# Altium schematic sheet Base.SchDoc
size Letter; CompanyName: Ploopy Corporation; Organization: Ploopy Corporation; Address1: 137-1140 Burnhamthorpe Road W; Address2: Mississauga; Address3: Ontario; Address4: Canada L5C 0A3; DocumentNumber: 1; Revision: R1.007; SheetNumber: 1; SheetTotal: 9
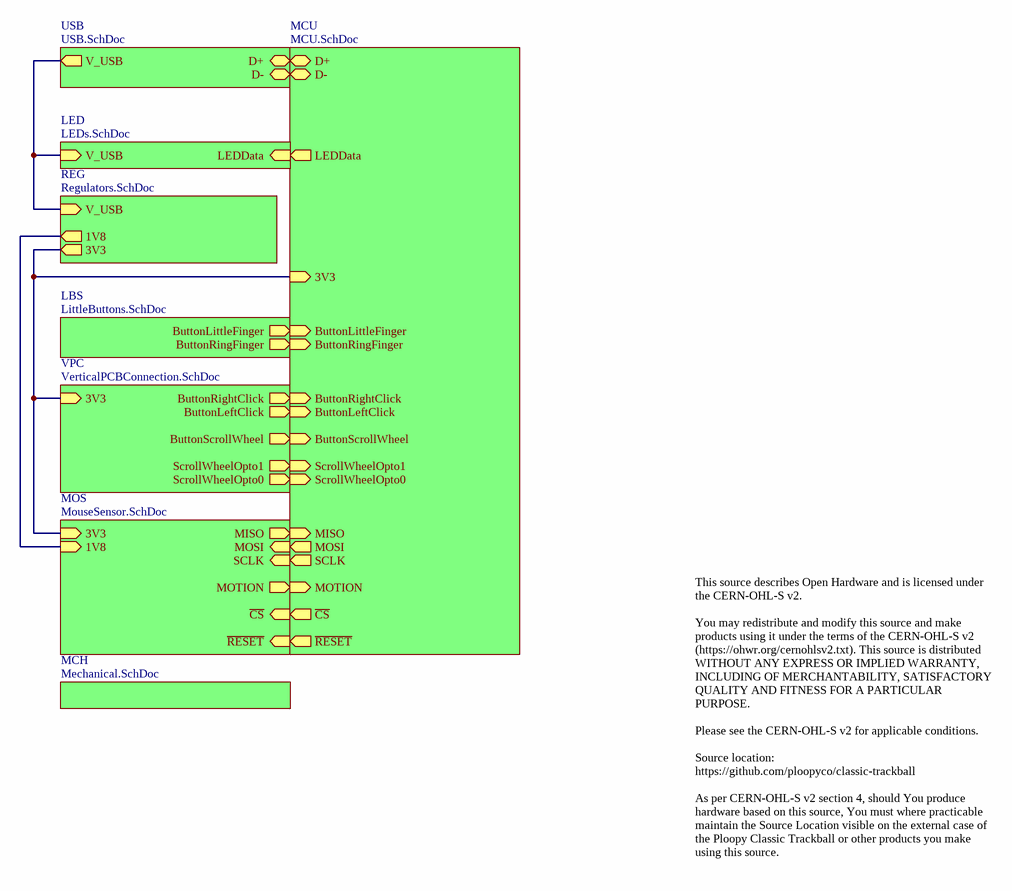
[diagram p0: Base.SchDoc]

## Sub-sheets
LBS = LittleButtons.SchDoc: ButtonLittleFinger (out), ButtonRingFinger (out)
LED = LEDs.SchDoc: V_USB (in), LEDData (in)
MCH = Mechanical.SchDoc: no entries
MCU = MCU.SchDoc: 3V3 (in), D+ (bidir), D- (bidir), ButtonRightClick (in), ButtonLeftClick (in), ScrollWheelOpto1 (in), ScrollWheelOpto0 (in), ButtonScrollWheel (in), ButtonLittleFinger (in), ButtonRingFinger (in), ~{CS} (out), MISO (in), MOSI (out), SCLK (out), ~{RESET} (out), MOTION (in), LEDData (out)
MOS = MouseSensor.SchDoc: 1V8 (in), 3V3 (in), ~{CS} (in), MISO (out), MOSI (in), SCLK (in), ~{RESET} (in), MOTION (out)
REG = Regulators.SchDoc: 3V3 (out), V_USB (in), 1V8 (out)
USB = USB.SchDoc: D+ (bidir), V_USB (out), D- (bidir)
VPC = VerticalPCBConnection.SchDoc: 3V3 (in), ButtonRightClick (out), ButtonLeftClick (out), ScrollWheelOpto1 (out), ScrollWheelOpto0 (out), ButtonScrollWheel (out)

## Nets
(unnamed): sheet REG/3V3, sheet VPC/3V3, sheet MOS/3V3, sheet MCU/3V3
(unnamed): sheet REG/V_USB, sheet USB/V_USB, sheet LED/V_USB
(unnamed): sheet REG/1V8, sheet MOS/1V8
(unnamed): sheet VPC/ButtonRightClick, sheet MCU/ButtonRightClick
(unnamed): sheet VPC/ButtonLeftClick, sheet MCU/ButtonLeftClick
(unnamed): sheet VPC/ScrollWheelOpto1, sheet MCU/ScrollWheelOpto1
(unnamed): sheet VPC/ScrollWheelOpto0, sheet MCU/ScrollWheelOpto0
(unnamed): sheet VPC/ButtonScrollWheel, sheet MCU/ButtonScrollWheel
(unnamed): sheet MOS/~{CS}, sheet MCU/~{CS}
(unnamed): sheet MOS/MISO, sheet MCU/MISO
(unnamed): sheet MOS/MOSI, sheet MCU/MOSI
(unnamed): sheet MOS/SCLK, sheet MCU/SCLK
(unnamed): sheet MOS/~{RESET}, sheet MCU/~{RESET}
(unnamed): sheet MOS/MOTION, sheet MCU/MOTION
(unnamed): sheet LBS/ButtonLittleFinger, sheet MCU/ButtonLittleFinger
(unnamed): sheet LBS/ButtonRingFinger, sheet MCU/ButtonRingFinger
(unnamed): sheet USB/D+, sheet MCU/D+
(unnamed): sheet USB/D-, sheet MCU/D-
(unnamed): sheet MCU/LEDData, sheet LED/LEDData

## Notes on the sheet
- This source describes Open Hardware and is licensed under the CERN-OHL-S v2.
  You may redistribute and modify this source and make products using it under the terms of the CERN-OHL-S v2 (https://ohwr.org/cernohlsv2.txt). This source is distributed WITHOUT ANY EXPRESS OR IMPLIED WARRANTY, INCLUDING OF MERCHANTABILITY, SATISFACTORY QUALITY AND FITNESS FOR A PARTICULAR PURPOSE.
  Please see the CERN-OHL-S v2 for applicable conditions.
  Source location:  https://github.com/ploopyco/classic-trackball
  As per CERN-OHL-S v2 section 4, should You produce hardware based on this source, You must where practicable maintain the Source Location visible on the external case of the Ploopy Classic Trackball or other products you make using this source.
- Copyright Ploopy Corporation 2024
- Licensed under the CERN-OHL-S v2
- http://ohwr.org/cernohl
- Title:
- PCB:
- Version:
- Ploopy Corporation
- Mississauga ON L5C 0A3
- 137-1140 Burnhamthorpe Road W
- Date:
- Time:
- Sheet
- of
- Canada